# EAGLE design DSRLTEMPController (EAGLE 7.0.0)
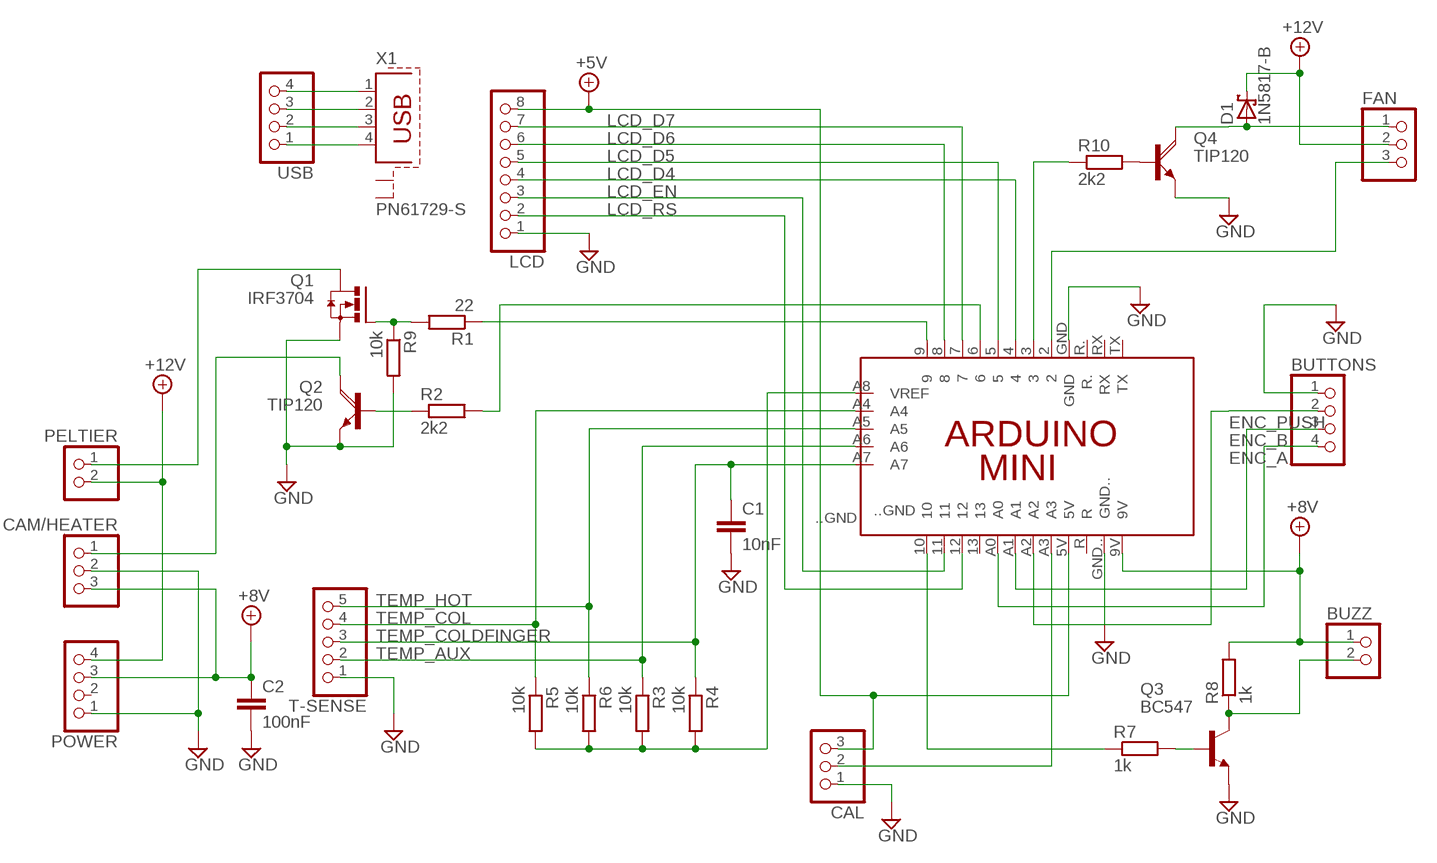
[diagram p0: schematic, sheet 1]

## Parts
BUTTONS  PINHD-1X4  [1X04]
BUZZ  PINHD-1X2  [1X02]
C1  10nF  C-EU025-024X044  [C025-024X044]
C2  100nF  C-EU025_050-025X075  [C025_050-025X075]
CAL  PINHD-1X3  [1X03]
CAM/HEATER  PINHD-1X3/90  [1X03/90]
D1  1N5817-B  [DO41-7.6]
FAN  PINHD-1X3/90  [1X03/90]
LCD  PINHD-1X8  [1X08]
PCB1  ARDUINO_MINI  [ARDUINO_MINI]
PELTIER  PINHD-1X2/90  [1X02/90]
POWER  PINHD-1X4/90  [1X04/90]
Q1  IRF3704  [TO220AH]
Q2  TIP120  [TO220AH]
Q3  BC547  [TO92]
Q4  TIP120  [TO220AH]
R1  22  R-EU_0207/7  [0207/7]
R2  2k2  R-EU_0207/7  [0207/7]
R3  10k  R-EU_0207/7  [0207/7]
R4  10k  R-EU_0207/7  [0207/7]
R5  10k  R-EU_0207/7  [0207/7]
R6  10k  R-EU_0207/7  [0207/7]
R7  1k  R-EU_0207/7  [0207/7]
R8  1k  R-EU_0207/7  [0207/7]
R9  10k  R-EU_0207/7  [0207/7]
R10  2k2  R-EU_0207/7  [0207/7]
T-SENSE  PINHD-1X5  [1X05]
USB  PINHD-1X4  [1X04]
X1  PN61729-S  [PN61729-S]

## Nets
+5V: CAL.3 LCD.8 PCB1.5V
+8V [Power]: BUZZ.1 C2.1 CAM/HEATER.3 PCB1.9V POWER.3 R8.2
+12V [Power]: D1.C FAN.2 PELTIER.2 POWER.4
ENC_A: BUTTONS.4 PCB1.A0
ENC_B: BUTTONS.3 PCB1.A1
ENC_PUSH: BUTTONS.2 PCB1.A2
GND [Power]: BUTTONS.1 C1.2 C2.2 CAL.1 CAM/HEATER.2 LCD.1 PCB1.GND PCB1.GND.. POWER.1 Q1.E(S) Q2.E Q3.1(E) Q4.E R9.2 T-SENSE.1
LCD_D4: LCD.5 PCB1.5
LCD_D5: LCD.4 PCB1.4
LCD_D6: PCB1.3 R10.1
LCD_D7: FAN.3 PCB1.2
LCD_EN: LCD.3 PCB1.11
LCD_RS: LCD.2 PCB1.12
N$1: Q2.B R2.1
N$2: PCB1.9 R1.1
N$3: PCB1.6 R2.2
N$4: Q1.B(G) R1.2 R9.1
N$5 [Power]: CAM/HEATER.1 Q2.C
N$6 [Power]: PELTIER.1 Q1.C(D)
N$7: PCB1.10 R7.1
N$8: BUZZ.2 Q3.3(C) R8.1
N$9: Q3.2(B) R7.2
N$10: LCD.6 PCB1.8
N$11: LCD.7 PCB1.7
N$12: Q4.B R10.2
N$13: USB.4 X1.1
N$14: D1.A FAN.1 Q4.C
N$15: USB.3 X1.2
N$16: USB.2 X1.3
N$17: USB.1 X1.4
N$18: CAL.2 PCB1.A3
TEMP_AUX: PCB1.A6 R3.1 T-SENSE.2
TEMP_COL: PCB1.A4 R5.1 T-SENSE.4
TEMP_COLDFINGER: C1.1 PCB1.A7 R4.1 T-SENSE.3
TEMP_HOT: PCB1.A5 R6.1 T-SENSE.5
VREF: PCB1.A8(VREF) R3.2 R4.2 R5.2 R6.2
Unconnected: PCB1.13 PCB1...GND PCB1.R PCB1.R. PCB1.RX PCB1.TX POWER.2 X1.S1 X1.S2

## Library data of the parts
BUTTONS POWER USB = pinhead:PINHD-1X4: PIN HEADER
BUZZ PELTIER = pinhead:PINHD-1X2: PIN HEADER
C1 C2 = resistor:C-EU: CAPACITOR, European symbol
CAL CAM/HEATER FAN = pinhead:PINHD-1X3: PIN HEADER
D1 = diode:1N581*: 1.0A SCHOTTKY BARRIER RECTIFIER Source: http://www.diodes.com/datasheets/ds23001.pdf
LCD = pinhead:PINHD-1X8: PIN HEADER
PCB1 = E14_Arduino:ARDUINO_MINI: Device for representing an Arduino Mini board with a footprint in an EAGLE design. Created by Dave Young for Element14. More EAGLE documentation at: http://www.element14.com/community/community/knode/cadsoft_eagle
Q1 = transistor-power:IRF3704: SMPS MOSFET HEXFET® Power MOSFET Source: http://www.irf.com/product-info/datasheets/data/irf3704.pdf
Q2 Q4 = transistor-power:TIP120: NPN DARLINGTON TRANSISTOR
Q3 = transistor-npn:BC547*: NPN Transistor
R1-R10 = resistor:R-EU_: RESISTOR, European symbol
T-SENSE = pinhead:PINHD-1X5: PIN HEADER
X1 = con-berg:PN61729-S: BERG USB connector; OC_FARNELL: unknown; OC_NEWARK: unknown

## Net classes
1 Power: width 0.813 mm, clearance 0.406 mm

## Board
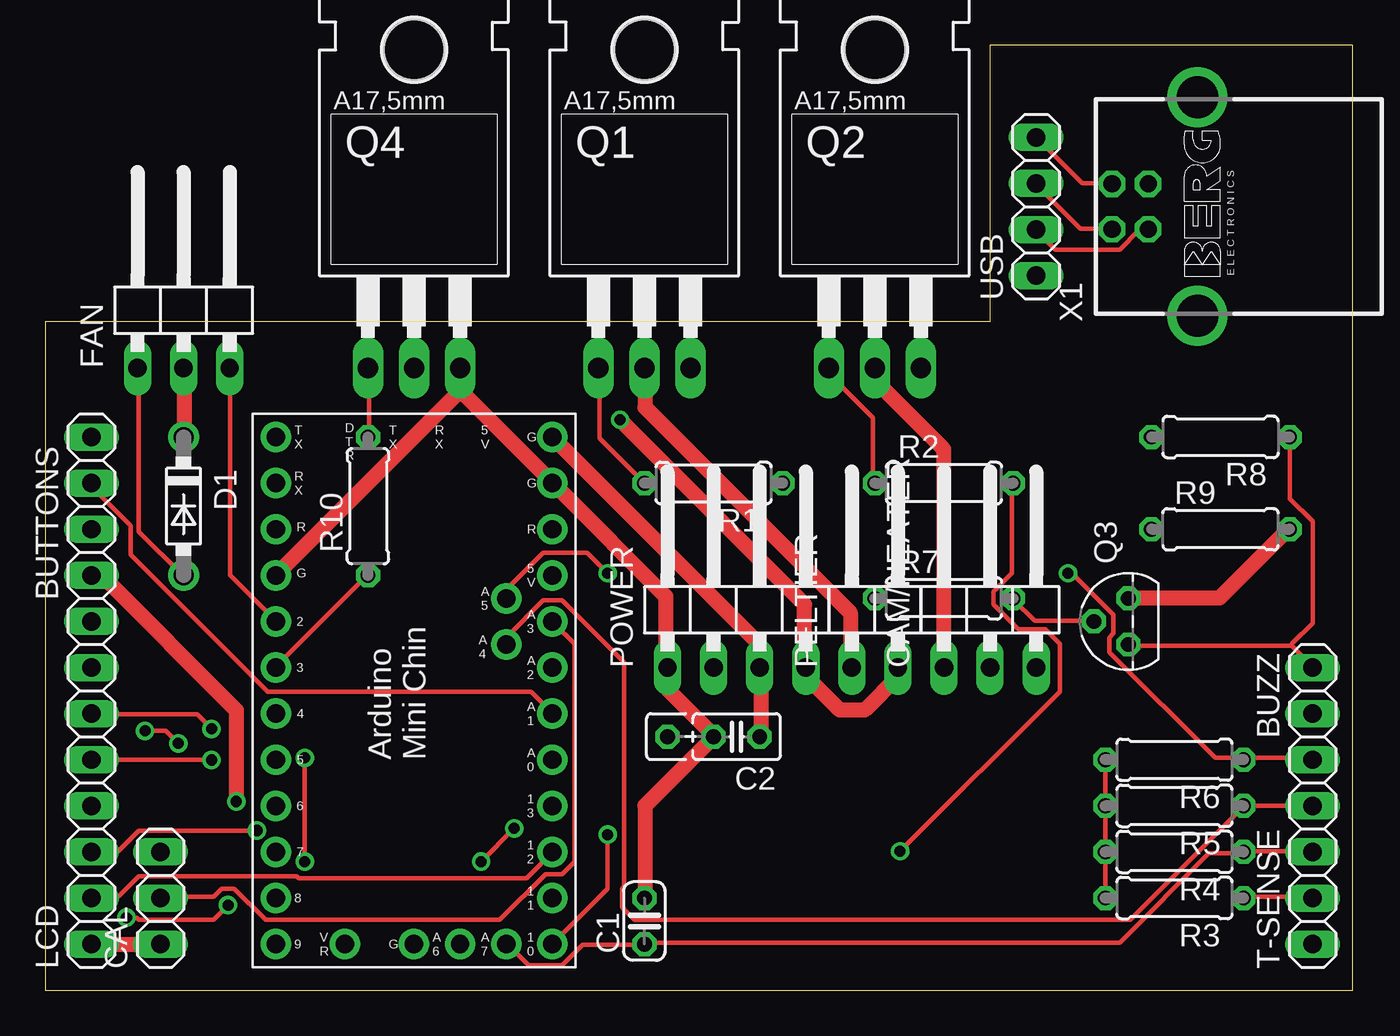
[diagram p1: board, top side]
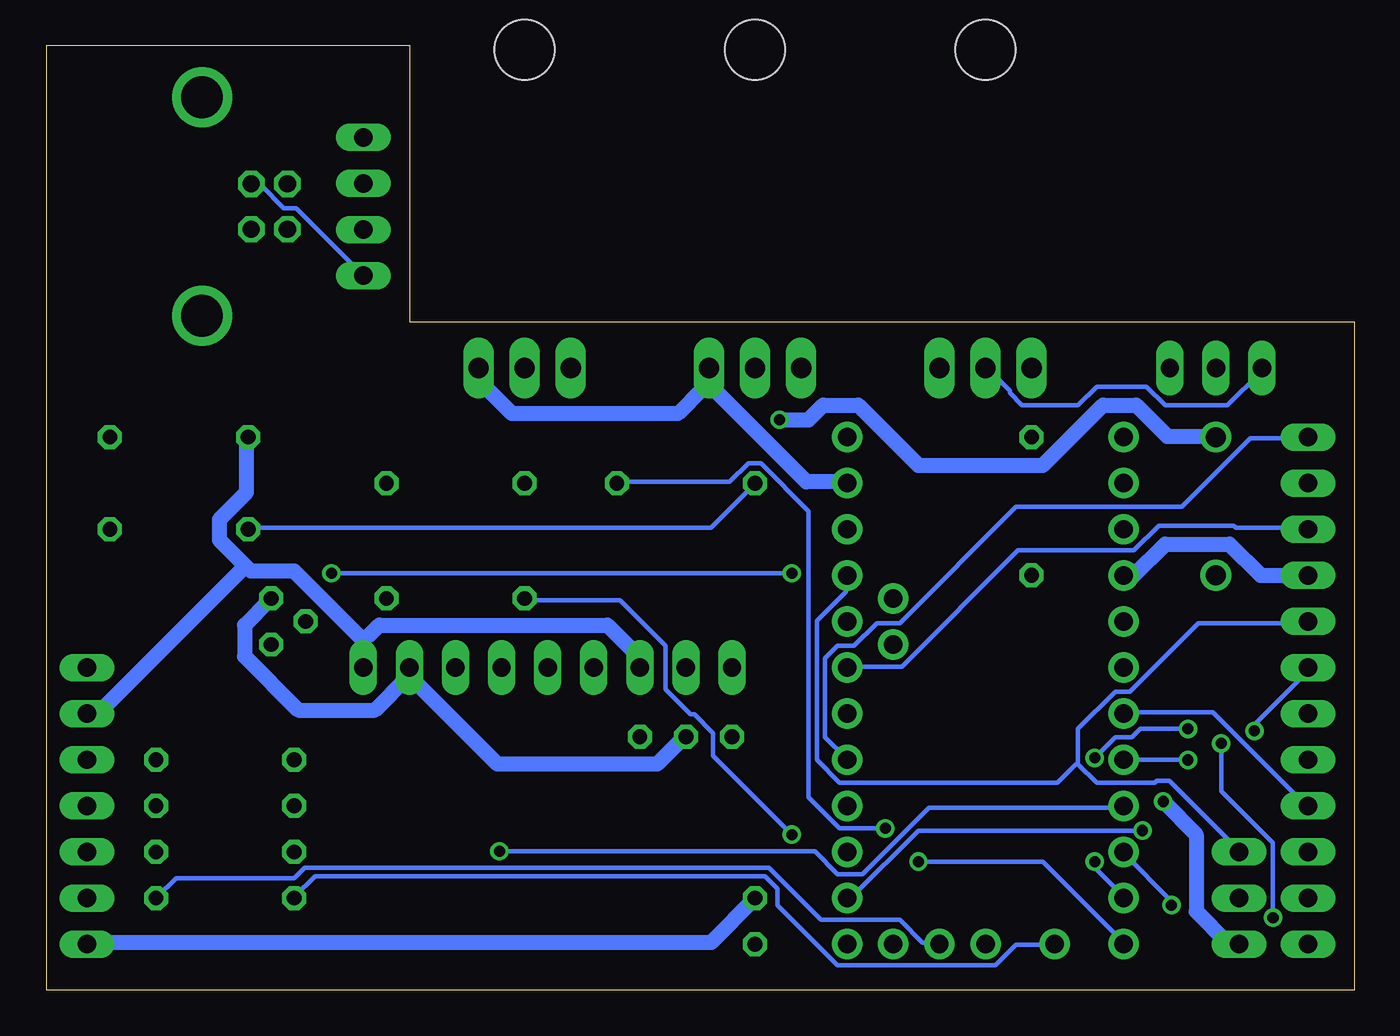
[diagram p2: board, bottom side, seen from below]

Size 72.06 x 52.06 mm. Coordinates in mm from the lower left corner, seen from the top.
Outline: 0,0 72.06,0 72.06,52.06 52.07,52.06 52.07,36.83 0,36.82 0,0
Copper layers (1*16): Top 0.035mm / dielectric 1.5mm / Bottom 0.035mm
Design rules "default": minimum track width 10mil, minimum drill 24mil, track to track 8mil, track to pad 8mil, pad to pad 8mil, via to via 8mil, smd to smd 8mil, copper to edge 40mil, drill to drill 8mil, minimum pad ring 10mil, minimum via ring 8mil, stop-mask expansion 4mil, vias tented up to drill 0mil, thermal gap 10mil

### Footprints (pad centres in the part's own frame; a part is rotated, then mirrored left to right if it is on the bottom)
1X04 = drill 1.016 long: 1 -3.81,0; 2 -1.27,0; 3 1.27,0; 4 3.81,0
1X02 = drill 1.016 long: 1 -1.27,0; 2 1.27,0
C025-024X044 = drill 0.813 octagon: 1 -1.27,0; 2 1.27,0
C025_050-025X075 = drill 0.813 octagon: 1 -1.27,0; 2 1.27,0; 3 3.81,0
1X03 = drill 1.016 long: 1 -2.54,0; 2 0,0; 3 2.54,0
1X03/90 = drill 1.016 long: 1 -2.54,-3.81; 2 0,-3.81; 3 2.54,-3.81
DO41-7.6 = drill 1.1 pad 1.7: A 3.81,0; C -3.81,0
1X08 = drill 1.016 long: 1 -8.89,0; 2 -6.35,0; 3 -3.81,0; 4 -1.27,0; 5 1.27,0; 6 3.81,0; 7 6.35,0; 8 8.89,0
ARDUINO_MINI = drill 1.016 pad 1.676: 2 19.05,16.51; 3 16.51,16.51; 4 13.97,16.51; 5 11.43,16.51; 5V 21.59,1.27; 6 8.89,16.51; 7 6.35,16.51; 8 3.81,16.51; 9 1.27,16.51; 9V 29.21,1.27; 10 1.27,1.27; 11 3.81,1.27; 12 6.35,1.27; 13 8.89,1.27; ..GND 1.27,8.89; A0 11.43,1.27; A1 13.97,1.27; A2 16.51,1.27; A3 19.05,1.27; A4 17.78,3.81; A5 20.32,3.81; A6 1.27,6.35; A7 1.27,3.81; A8 1.27,12.7; GND 21.59,16.51; GND.. 26.67,1.27; R 24.13,1.27; R. 24.13,16.51; RX 26.67,16.51; TX 29.21,16.51
1X02/90 = drill 1.016 long: 1 -1.27,-3.81; 2 1.27,-3.81
1X04/90 = drill 1.016 long: 1 -3.81,-3.81; 2 -1.27,-3.81; 3 1.27,-3.81; 4 3.81,-3.81
TO220AH = drill 1.118 long: B -2.54,-6.35; C 0,-6.35; E 2.54,-6.35 | hole 3.302: 0,11.176
TO92 = drill 0.813 octagon: 1 1.27,0; 2 0,1.905; 3 -1.27,0
0207/7 = drill 0.813 octagon: 1 -3.81,0; 2 3.81,0
1X05 = drill 1.016 long: 1 -5.08,0; 2 -2.54,0; 3 0,0; 4 2.54,0; 5 5.08,0
PN61729-S = drill 0.95 octagon: 1 1.25,4.71; 2 -1.25,4.71; 3 -1.25,2.71; 4 1.25,2.71 | drill 2.3 pad 2.9: S1 -6.02,0; S2 6.02,0

### Placement (x,y rotation side)
BUTTONS  2.54,26.67 90 top
BUZZ  69.85,16.51 90 top
C1  33.02,3.81 90 top
C2  38.1,13.97 180 top
CAL  6.35,5.08 90 top
CAM/HEATER  52.07,21.59 0 top
D1  7.62,26.67 270 top
FAN  7.62,38.1 0 top
LCD  2.54,11.43 90 top
PCB1  29.21,1.27 90 top
PELTIER  45.72,21.59 0 top
POWER  38.1,21.59 0 top
Q1  33.02,40.64 0 top
Q2  45.72,40.64 0 top
Q3  59.69,20.32 90 top
Q4  20.32,40.64 0 top
R1  36.83,27.94 180 top
R2  49.53,27.94 0 top
R3  62.23,5.08 180 top
R4  62.23,7.62 180 top
R5  62.23,10.16 180 top
R6  62.23,12.7 180 top
R7  49.53,21.59 0 top
R8  64.77,30.48 180 top
R9  64.77,25.4 0 top
R10  17.78,26.67 90 top
T-SENSE  69.85,7.62 90 top
USB  54.61,43.18 90 top
X1  63.5,43.18 90 top

### Tracks (layer width: path | path; a pad name or v marks a point on that pad's centre or on a via)
+5V
  Bottom 0.254: 15.21,12.46 15.21,14.4 13.16,16.46 12.36,16.46 8.59,20.23 2.64,20.23 LCD.8 | 15.21,12.46 14.19,11.43 10.99,11.43 10.87,11.54 10.18,11.54 6.3,7.66 CAL.3 | PCB1.5V 28.02,22.86 28.02,21.95 29.62,20.34 29.62,12.69 28.36,11.43 16.36,11.43 15.33,12.46 15.21,12.46
+8V
  Top 0.813: C2.1 39.45,14.06 39.45,17.72 POWER.3 39.22,18.17 39.22,19.2 28.02,30.4 PCB1.9V
  Bottom 0.813: 61.11,23.37 60.82,23.09 58.42,23.09 54.65,19.32 | 61.11,23.37 62.54,24.8 62.54,25.95 61.05,27.43 61.05,30.4 R8.2 | 54.65,19.32 54.65,17.83 CAM/HEATER.3 | BUZZ.1 69.85,15.32 69.16,15.32 61.39,23.09 61.11,23.37 | POWER.3 39.45,17.83 39.45,18.4 41.16,20.12 53.73,20.12 54.3,19.55 54.65,19.32
+12V  (via drill 0.61)
  Top 0.813: FAN.2 7.67,34.29 7.67,30.52 D1.C | PELTIER.2 46.99,17.72 46.99,17.26 45.16,15.43 43.79,15.43 41.96,17.26 41.96,17.72 POWER.4 41.85,18.17 41.85,21.26 v31.67,31.43
  Bottom 0.813: v31.67,31.43 30.07,31.43 29.27,32.23 27.33,32.23 24.02,28.92 17.16,28.92 13.84,32.23 12.01,32.23 10.3,30.52 7.67,30.52 D1.C
ENC_A
  Bottom 0.254: BUTTONS.4 2.64,30.4 5.73,30.4 9.5,26.63 18.64,26.63 25.04,20.23 26.3,20.23 27.56,18.97 28.47,18.97 29.16,18.29 29.16,13.95 28.02,12.8 PCB1.A0
ENC_B
  Top 0.254: BUTTONS.3 2.64,27.89 2.64,27.66 4.7,25.6 4.7,24 12.24,16.46 26.76,16.46 27.9,15.32 PCB1.A1
ENC_PUSH
  Bottom 0.254: BUTTONS.2 2.64,25.49 6.53,25.49 6.64,25.6 10.76,25.6 12.13,24.23 18.53,24.23 24.93,17.83 27.9,17.83 PCB1.A2
GND  (via drill 0.61)
  Top 0.813: Q3.1 59.79,21.6 64.71,21.6 68.48,25.38 R9.2 | C1.2 33.05,5.14 33.05,10.17 36.82,13.95 C2.2 36.59,14.29 34.3,16.57 34.3,17.72 POWER.1 34.19,18.17 34.19,21.72 28.25,27.66 PCB1.GND.. 27.9,28 22.87,33.03 22.87,34.29 Q4.E 22.64,32.8 PCB1.GND | LCD.1 2.64,2.52 6.3,2.52 CAL.1 | v10.53,10.4 10.53,15.43 3.1,22.86 2.64,22.86 BUTTONS.1
  Bottom 0.813: Q3.1 59.79,21.49 61.16,20.12 61.16,18.4 58.19,15.43 53.96,15.43 52.13,17.26 52.13,17.72 CAM/HEATER.2 51.79,17.03 47.22,12.46 38.42,12.46 36.93,13.95 C2.2 | T-SENSE.1 69.85,2.63 35.45,2.63 33.05,5.03 C1.2 | PCB1.GND 12.13,22.86 10.41,24.57 6.87,24.57 5.16,22.86 2.64,22.86 BUTTONS.1 | v10.53,10.4 8.7,8.57 8.7,4.34 6.98,2.63 6.41,2.63 CAL.1 | PCB1.GND.. 28.02,28 30.19,28 35.56,33.38 Q1.E 35.9,33.15 37.28,31.77 46.42,31.77 48.25,33.6 48.25,34.29 Q2.E
LCD_D4  (via drill 0.61)
  Top 0.254: v9.16,12.69 2.64,12.69 LCD.5
  Bottom 0.254: v9.16,12.69 12.7,12.69 PCB1.5
LCD_D5
  Bottom 0.254: LCD.4 2.64,10.17 7.79,15.32 12.7,15.32 PCB1.4
LCD_D6
  Top 0.254: R10.1 17.73,22.86 12.7,17.83 PCB1.3
LCD_D7
  Top 0.254: FAN.3 10.18,34.29 10.18,22.86 12.7,20.34 PCB1.2
LCD_EN  (via drill 0.61)
  Top 0.254: v11.67,8.8 5.16,8.8 4.01,7.66 2.64,7.66 LCD.3
  Bottom 0.254: v11.67,8.8 24.02,8.8 27.67,5.14 27.9,5.14 PCB1.11
LCD_RS
  Top 0.254: LCD.2 2.64,5.14 4.01,5.14 5.16,6.29 13.84,6.29 13.96,6.17 26.53,6.17 27.9,7.54 PCB1.12
N$1
  Top 0.254: R2.1 45.62,28 45.62,31.55 43.22,33.95 43.22,34.29 Q2.B
N$2  (via drill 0.61)
  Top 0.254: v24.02,7.09 v25.84,8.91
  Bottom 0.254: v25.84,8.91 28.36,8.91 30.07,10.63 30.07,26.4 32.7,29.03 33.39,29.03 34.42,28 40.59,28 R1.1 | v24.02,7.09 17.16,7.09 12.7,2.63 PCB1.9
N$3  (via drill 0.61)
  Top 0.254: v47.1,7.66 55.91,16.46 55.91,19.09 55.11,19.89 53.62,19.89 52.25,21.26 52.25,21.95 53.28,22.97 53.28,27.89 R2.2
  Bottom 0.254: v47.1,7.66 29.73,7.66 28.47,6.4 27.1,6.4 23.44,10.06 12.7,10.06 PCB1.6
N$4
  Top 0.254: Q1.B 30.53,34.29 30.53,30.4 32.93,28 R1.2
  Bottom 0.254: R9.1 60.94,25.49 35.45,25.49 33.05,27.89 R1.2
N$5
  Top 0.813: CAM/HEATER.1 49.51,17.83 49.51,29.83 45.73,33.6 45.73,34.29 Q2.C
N$6
  Top 0.813: PELTIER.1 44.36,17.83 44.36,20.8 33.05,32.12 33.05,34.29 Q1.C
N$7  (via drill 0.61)
  Top 0.254: v30.99,8.57 30.99,5.6 28.02,2.63 PCB1.10
  Bottom 0.254: v30.99,8.57 35.33,12.92 35.33,14.17 36.36,15.2 36.59,15.2 37.96,16.57 37.96,18.97 40.48,21.49 45.62,21.49 R7.1
N$8
  Top 0.254: 68.71,18.97 59.79,18.97 Q3.3 | 68.71,18.97 69.85,17.83 BUZZ.2 | R8.1 68.59,30.4 68.59,27.09 69.85,25.83 69.85,20.23 68.71,19.09 68.71,18.97
N$9
  Top 0.254: Q3.2 57.73,20.34 54.53,20.34 53.39,21.49 R7.2
N$10  (via drill 0.61)
  Top 0.254: v9.16,14.4 8.36,15.2 2.64,15.2 LCD.6 | v14.3,7.09 v14.3,12.8
  Bottom 0.254: v9.16,14.4 11.79,14.4 12.24,13.95 13.16,13.95 v14.3,12.8 | v14.3,7.09 14.3,6.74 12.7,5.14 PCB1.8
N$11  (via drill 0.61)
  Top 0.254: v5.5,14.29 6.64,14.29 v7.33,13.6 | v4.47,4 5.04,4 5.16,3.89 9.27,3.89 v10.07,4.69
  Bottom 0.254: v5.5,14.29 5.5,14.63 2.64,17.49 2.64,17.72 LCD.7 | v7.33,13.6 7.33,10.97 4.47,8.12 v4.47,4 | v10.07,4.69 10.07,4.92 12.7,7.54 PCB1.7
N$12
  Top 0.254: R10.2 17.84,30.52 17.84,34.29 Q4.B
N$13
  Top 0.254: X1.1 58.76,44.46 57.16,44.46 54.65,46.98 USB.4
N$14
  Top 0.254: FAN.1 5.16,34.29 5.16,25.26 7.56,22.86 D1.A
  Bottom 0.254: Q4.C 20.24,34.29 18.99,33.03 18.99,32.92 18.3,32.23 15.21,32.23 14.19,33.26 11.44,33.26 10.41,32.23 6.98,32.23 5.16,34.06 5.16,34.29 FAN.1
N$15
  Top 0.254: X1.2 58.76,41.95 57.05,41.95 54.65,44.35 USB.3
N$16
  Top 0.254: X1.3 60.71,41.83 60.25,41.83 59.22,40.8 55.68,40.8 54.65,41.83 USB.2
N$17
  Bottom 0.254: X1.4 60.71,44.35 60.25,44.35 58.99,43.09 58.31,43.09 54.65,39.43 USB.1
N$18
  Top 0.254: CAL.2 6.41,5.14 9.27,5.14 9.73,5.6 10.41,5.6 12.13,3.89 25.04,3.89 27.56,6.4 28.47,6.4 29.16,7.09 29.16,19.09 28.02,20.23 PCB1.A3
TEMP_AUX
  Top 0.254: R3.1 66.08,5.14 69.85,5.14 T-SENSE.2
  Bottom 0.254: PCB1.A6 22.87,2.63 23.79,2.63 25.04,3.89 29.39,3.89 32.25,6.74 57.85,6.74 58.42,6.17 64.94,6.17 65.96,5.14 R3.1
TEMP_COL
  Top 0.254: T-SENSE.4 69.85,10.17 66.08,10.17 R5.1 65.96,10.06 59.79,3.89 32.47,3.89 31.79,4.57 31.79,5.6 31.9,5.71 31.9,18.06 28.47,21.49 27.45,21.49 25.5,19.55 25.5,19.09 PCB1.A4
TEMP_COLDFINGER
  Top 0.254: T-SENSE.3 69.85,7.66 66.08,7.66 R4.1 65.96,7.54 64.14,7.54 59.22,2.63 33.05,2.63 C1.1 32.93,2.52 29.62,2.52 28.47,1.37 26.64,1.37 25.5,2.52 PCB1.A7
TEMP_HOT  (via drill 0.61)
  Top 0.254: T-SENSE.5 69.85,12.8 66.08,12.8 R6.1 65.96,12.8 64.48,12.8 58.65,18.63 58.65,19.43 58.88,19.66 58.88,20.69 56.59,22.97 v56.36,22.97 | v30.99,22.97 29.84,24.12 27.45,24.12 25.5,22.17 25.5,21.6 PCB1.A5
  Bottom 0.254: v56.36,22.97 v30.99,22.97
VREF
  Top 0.254: R3.2 58.42,5.14 58.42,7.54 R4.2 58.42,7.66 58.42,10.06 R5.2 58.42,10.17 58.42,12.69 R6.2
  Bottom 0.254: PCB1.A8 16.59,2.52 18.64,2.52 19.79,1.37 28.47,1.37 31.79,4.69 31.79,5.6 32.47,6.29 57.28,6.29 58.42,5.14 R3.2